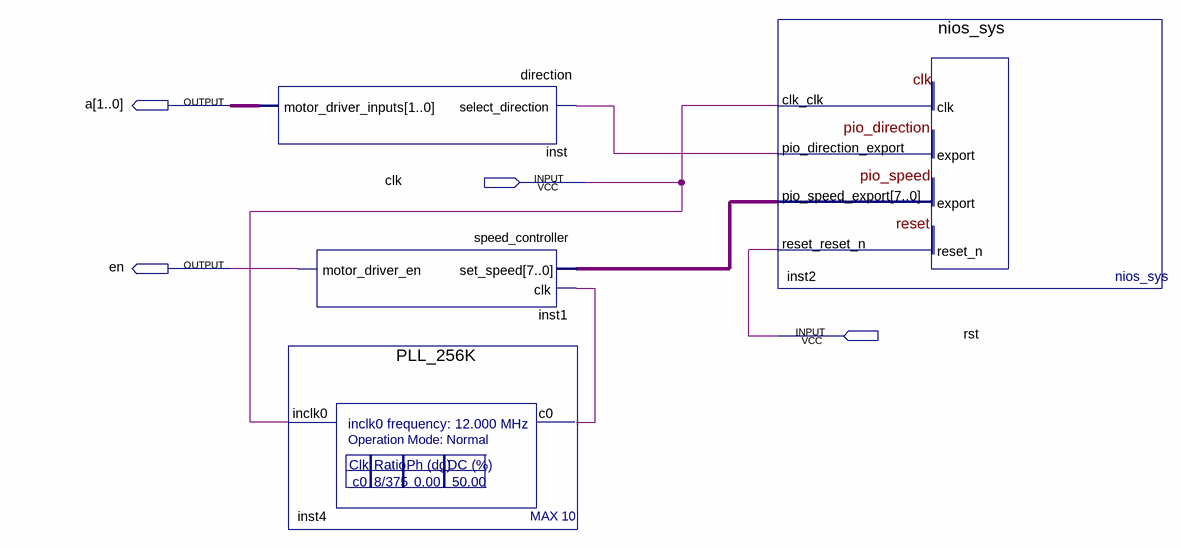
[diagram p0: schematic sheet]
// Quartus schematic dc_motor.bdf as structural Verilog: 4 symbols, 4 pins
module dc_motor (
  input  clk,
  input  rst,
  output [1:0] a,
  output en
);

  wire inst2_pio_direction_export, inst4_c0;
  wire [7:0] inst2_pio_speed_export;

  direction inst (.select_direction(inst2_pio_direction_export), .motor_driver_inputs(a));
  speed_controller inst1 (.set_speed(inst2_pio_speed_export), .clk(inst4_c0), .motor_driver_en(en));
  PLL_256K inst4 (.inclk0(clk), .c0(inst4_c0));
  nios_sys inst2 (
    .clk_clk(clk), .reset_reset_n(rst), .pio_direction_export(inst2_pio_direction_export),
    .pio_speed_export(inst2_pio_speed_export));
endmodule
